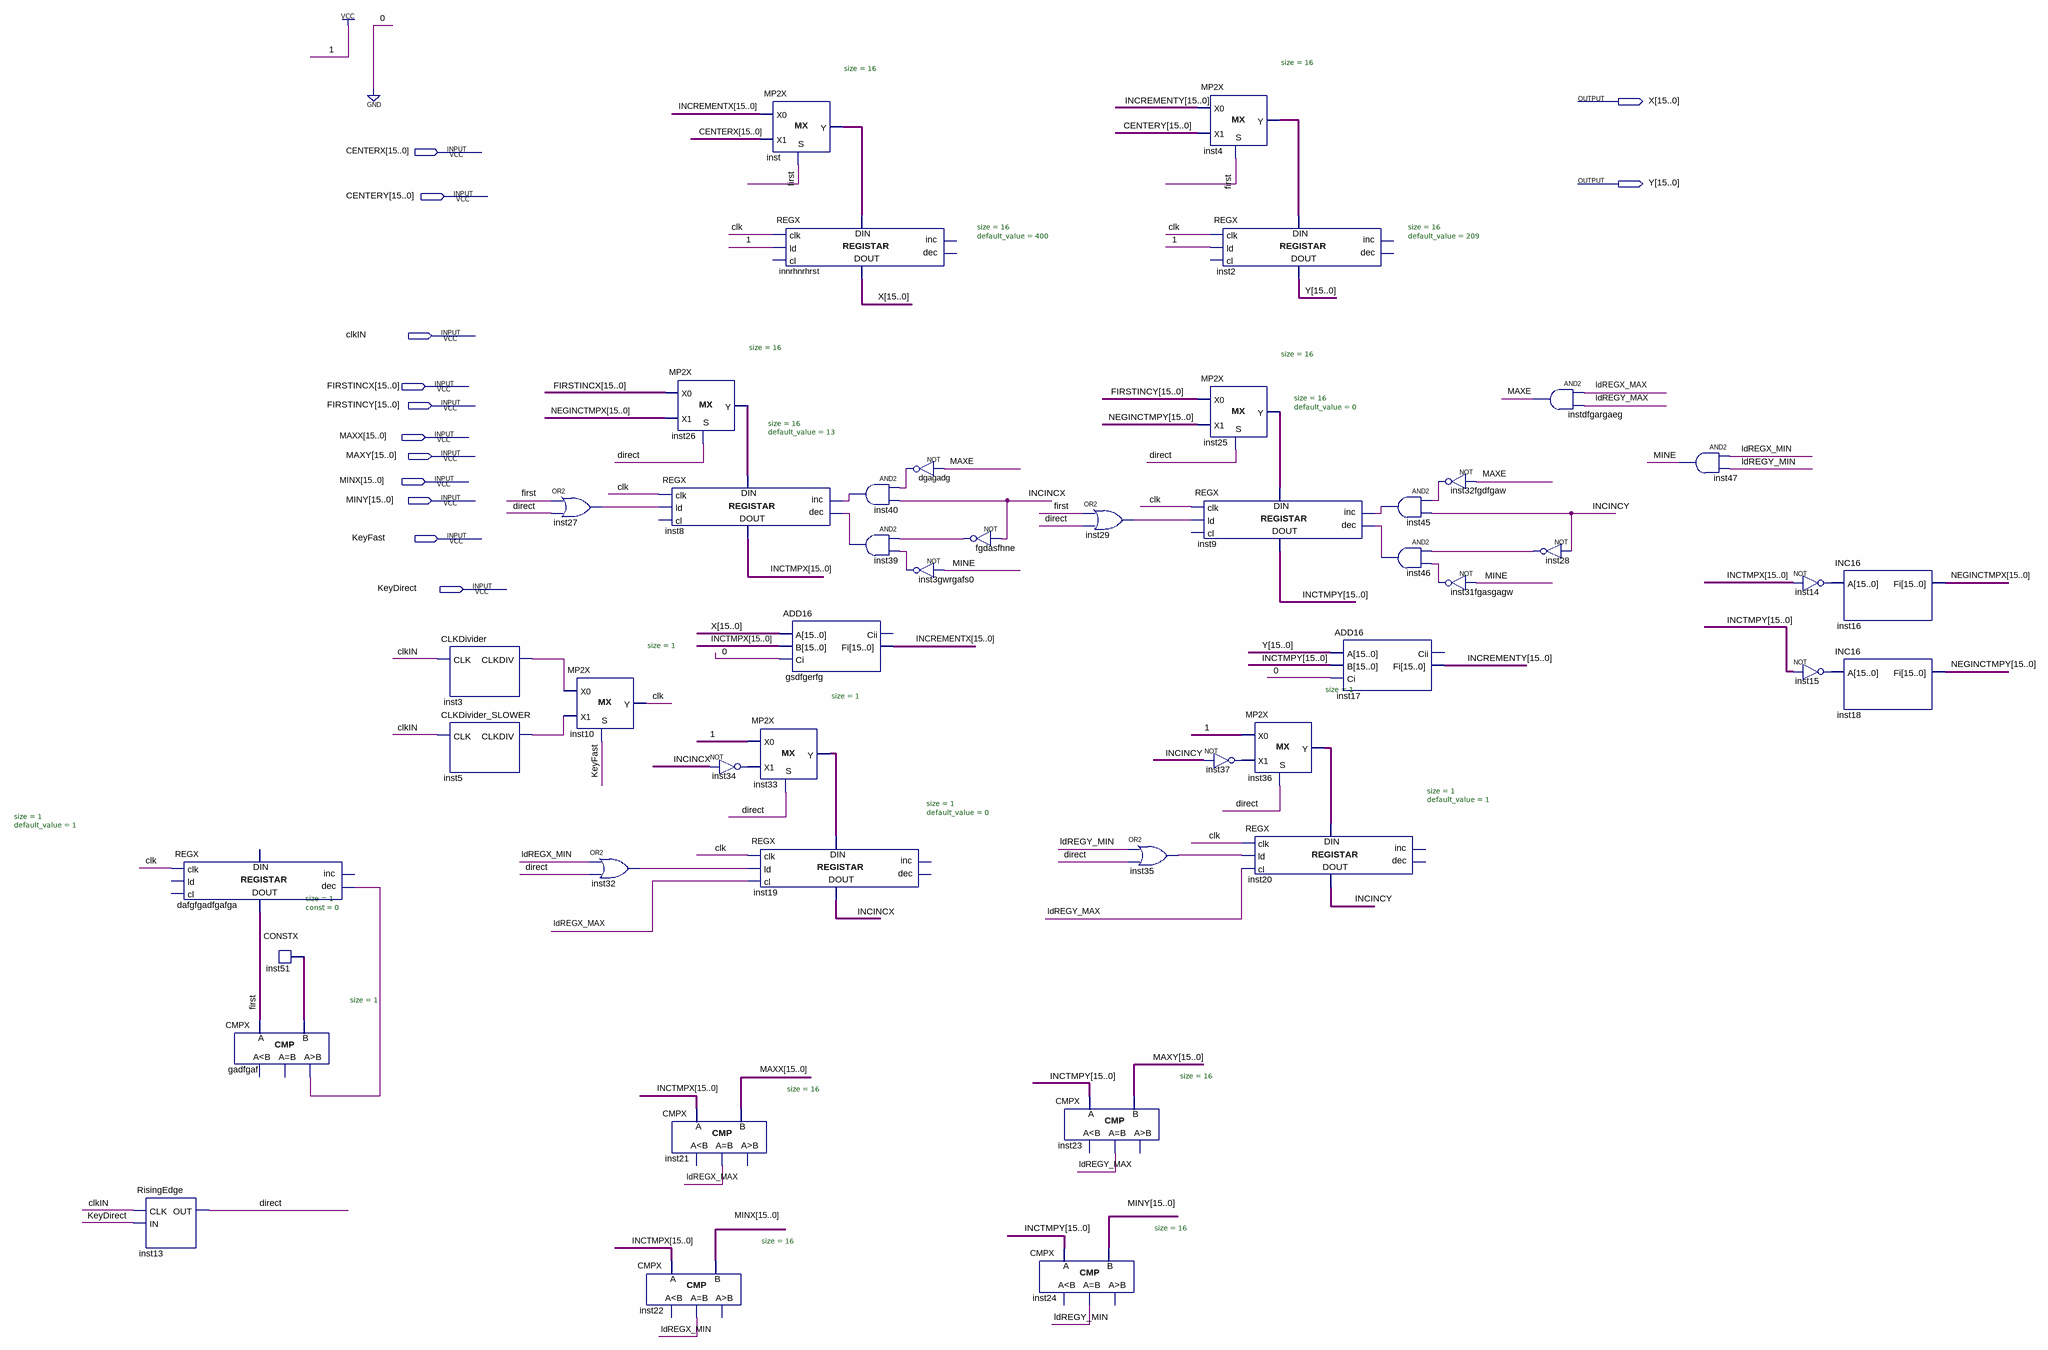
[diagram p0: schematic sheet]
// Quartus schematic PlanetReg.bdf as structural Verilog: 47 symbols, 13 pins
module PlanetReg (
  input  [15:0] CENTERX,
  input  [15:0] CENTERY,
  input  clkIN,
  input  [15:0] FIRSTINCX,
  input  [15:0] FIRSTINCY,
  input  [15:0] MAXX,
  input  [15:0] MAXY,
  input  [15:0] MINX,
  input  [15:0] MINY,
  input  KeyFast,
  input  KeyDirect,
  output [15:0] X,
  output [15:0] Y
);

  wire clk, dgagadg_out, direct, fgdasfhne_out, first, gadfgaf_gr, INCINCX, INCINCY, inst3_clkdiv,
       inst3gwrgafs0_out, inst5_clkdiv, inst27_out, inst28_out, inst29_out, inst31fgasgagw_out, inst32_out,
       inst32fgdfgaw_out, inst33_y, inst34_out, inst35_out, inst36_y, inst37_out, inst39_out, inst40_out,
       inst45_out, inst46_out, inst51_data, ldREGX_MAX, ldREGX_MIN, ldREGY_MAX, ldREGY_MIN, MAXE, MINE;
  wire [15:0] INCREMENTX, INCREMENTY, INCTMPX, INCTMPY, inst4_y, inst14_out, inst15_out, inst25_y, inst26_y,
       inst_y, NEGINCTMPX, NEGINCTMPY;

  RisingEdge inst13 (.CLK(clkIN), .IN(KeyDirect), .OUT(direct));
  REGX #(.size(1), .default_value(1)) dafgfgadfgafga (
    .clk(clk), .dec(gadfgaf_gr), .data_out(first));  // open: ld, cl, inc, data_in
  CMPX #(.size(1)) gadfgaf (.A(first), .B(inst51_data), .gr(gadfgaf_gr));  // open: ls, eq
  CONSTX #(.size(1), .\const (0)) inst51 (.data(inst51_data));
  CLKDivider inst3 (.CLK(clkIN), .CLKDIV(inst3_clkdiv));
  CLKDivider_SLOWER inst5 (.CLK(clkIN), .CLKDIV(inst5_clkdiv));
  or inst27 (inst27_out, first, direct);
  MP2X #(.size(1)) inst10 (.S(KeyFast), .X0(inst3_clkdiv), .X1(inst5_clkdiv), .Y(clk));
  or inst32 (inst32_out, ldREGX_MIN, direct);
  REGX #(.size(16), .default_value(13)) inst8 (
    .clk(clk), .ld(inst27_out), .inc(inst40_out), .dec(inst39_out), .data_in(inst26_y), .data_out(INCTMPX));  // open: cl
  CMPX #(.size(16)) inst21 (.A(INCTMPX), .B(MAXX), .eq(ldREGX_MAX));  // open: ls, gr
  CMPX #(.size(16)) inst22 (.A(INCTMPX), .B(MINX), .eq(ldREGX_MIN));  // open: ls, gr
  MP2X #(.size(16)) inst26 (.S(direct), .X0(FIRSTINCX), .X1(NEGINCTMPX), .Y(inst26_y));
  not inst34 (inst34_out, INCINCX);
  MP2X #(.size(16)) inst (.S(first), .X0(INCREMENTX), .X1(CENTERX), .Y(inst_y));
  MP2X #(.size(1)) inst33 (.S(direct), .X0(1'b1), .X1(inst34_out), .Y(inst33_y));
  REGX #(.size(1), .default_value(0)) inst19 (
    .clk(clk), .ld(inst32_out), .cl(ldREGX_MAX), .data_in(inst33_y), .data_out(INCINCX));  // open: inc, dec
  REGX #(.size(16), .default_value(400)) innrhnrhrst (
    .clk(clk), .ld(1'b1), .data_in(inst_y), .data_out(X));  // open: cl, inc, dec
  ADD16 gsdfgerfg (.A(X), .B(INCTMPX), .Ci(1'b0), .Fi(INCREMENTX));  // open: Cii
  and inst40 (inst40_out, dgagadg_out, INCINCX);
  and inst39 (inst39_out, fgdasfhne_out, inst3gwrgafs0_out);
  not dgagadg (dgagadg_out, MAXE);
  not inst3gwrgafs0 (inst3gwrgafs0_out, MINE);
  not fgdasfhne (fgdasfhne_out, INCINCX);
  CMPX #(.size(16)) inst23 (.A(INCTMPY), .B(MAXY), .eq(ldREGY_MAX));  // open: ls, gr
  CMPX #(.size(16)) inst24 (.A(INCTMPY), .B(MINY), .eq(ldREGY_MIN));  // open: ls, gr
  or inst29 (inst29_out, first, direct);
  or inst35 (inst35_out, ldREGY_MIN, direct);
  MP2X #(.size(16)) inst4 (.S(first), .X0(INCREMENTY), .X1(CENTERY), .Y(inst4_y));
  REGX #(.size(16), .default_value(209)) inst2 (
    .clk(clk), .ld(1'b1), .data_in(inst4_y), .data_out(Y));  // open: cl, inc, dec
  MP2X #(.size(16)) inst25 (.S(direct), .X0(FIRSTINCY), .X1(NEGINCTMPY), .Y(inst25_y));
  REGX #(.size(16), .default_value(0)) inst9 (
    .clk(clk), .ld(inst29_out), .inc(inst45_out), .dec(inst46_out), .data_in(inst25_y), .data_out(INCTMPY));  // open: cl
  not inst37 (inst37_out, INCINCY);
  MP2X #(.size(1)) inst36 (.S(direct), .X0(1'b1), .X1(inst37_out), .Y(inst36_y));
  REGX #(.size(1), .default_value(1)) inst20 (
    .clk(clk), .ld(inst35_out), .cl(ldREGY_MAX), .data_in(inst36_y), .data_out(INCINCY));  // open: inc, dec
  ADD16 inst17 (.A(Y), .B(INCTMPY), .Ci(1'b0), .Fi(INCREMENTY));  // open: Cii
  and inst45 (inst45_out, inst32fgdfgaw_out, INCINCY);
  and inst46 (inst46_out, inst28_out, inst31fgasgagw_out);
  not inst32fgdfgaw (inst32fgdfgaw_out, MAXE);
  not inst31fgasgagw (inst31fgasgagw_out, MINE);
  and instdfgargaeg (MAXE, ldREGX_MAX, ldREGY_MAX);
  not inst28 (inst28_out, INCINCY);
  and inst47 (MINE, ldREGX_MIN, ldREGY_MIN);
  assign inst14_out = ~INCTMPX;  // NOT inst14, 16 bits wide
  assign inst15_out = ~INCTMPY;  // NOT inst15, 16 bits wide
  INC16 inst16 (.A(inst14_out), .Fi(NEGINCTMPX));
  INC16 inst18 (.A(inst15_out), .Fi(NEGINCTMPY));
endmodule
